# EAGLE design RightSensor (EAGLE 9.1.3)
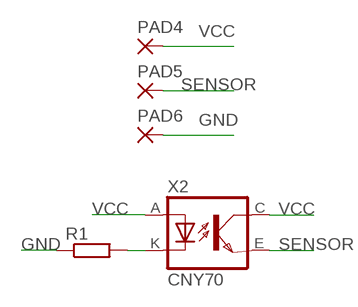
[diagram p0: schematic, sheet 1]

## Parts
PAD4  WIREPADSMD1,27-254  [SMD1,27-2,54]
PAD5  WIREPADSMD1,27-254  [SMD1,27-2,54]
PAD6  WIREPADSMD1,27-254  [SMD1,27-2,54]
R1  RCL_R-EU_R0805  [RCL_R0805]
X2  CNY70  [4]

## Nets
GND: PAD6.1(P) R1.1
N$1: R1.2 X2.K(C)
SENSOR: PAD5.1(P) X2.E(EMI)
VCC: PAD4.1(P) X2.A X2.C(COL)

## Library data of the parts
PAD4-PAD6 = wirepad:WIREPAD: Wire PAD connect wire on PCB
R1 = ScyllAlarmV3.0:RCL_R-EU_: RESISTOR, European symbol
X2 = cny70:CNY70

## Board
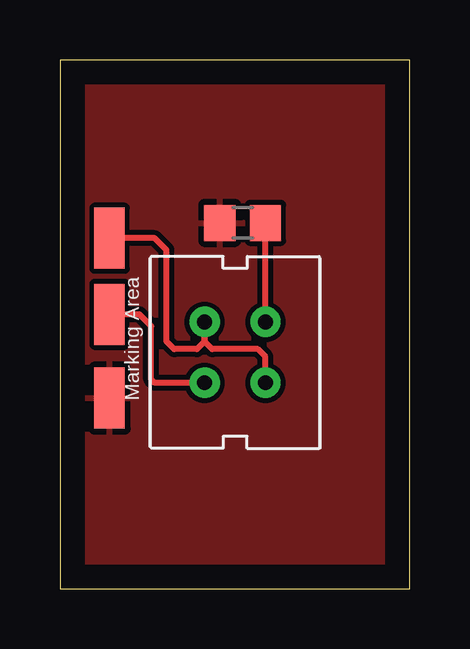
[diagram p1: board, top side]

Size 14.59 x 22.05 mm. Coordinates in mm from the lower left corner, seen from the top.
Outline: 0,0 14.59,0 14.59,22.05 0,22.05 0,0
Copper layers (1*16): Top 0.035mm / dielectric 1.5mm / Bottom 0.035mm
Design rules "default": minimum track width 10mil, minimum drill 24mil, track to track 8mil, track to pad 8mil, pad to pad 8mil, via to via 8mil, smd to smd 8mil, copper to edge 40mil, drill to drill 8mil, minimum pad ring 10mil, minimum via ring 8mil, stop-mask expansion 4mil, vias tented up to drill 0mil, thermal gap 10mil

### Footprints (pad centres in the part's own frame; a part is rotated, then mirrored left to right if it is on the bottom)
SMD1,27-2,54 = smd 1.27 x 2.54: 1 0,0
RCL_R0805 = smd 1.3 x 1.5: 1 -0.95,0; 2 0.95,0
4 = drill 0.61 pad 1.27: A -1.27,1.27; C 1.27,-1.27; E 1.27,1.27; K -1.27,-1.27

### Placement (x,y rotation side)
PAD4  2.06,14.62 180 top
PAD5  2.06,11.45 180 top
PAD6  2.06,7.95 180 top
R1  7.62,15.26 0 top
X2  7.3,9.86 180 top

### Tracks (layer width: path | path; a pad name or v marks a point on that pad's centre or on a via)
GND
  pour Top: 0,22.07 14.61,22.07 14.61,0 0,0
N$1
  Top 0.254: X2.K R1.2
SENSOR
  Top 0.254: X2.E 3.95,8.59 3.81,8.73 3.81,10.95 3.32,11.45 PAD5.1
VCC
  Top 0.254: X2.A 8.57,9.68 8.26,10 6.35,10 6.03,10.32 | 6.03,10.32 X2.C 6.03,10.32 | 6.03,10.32 5.71,10 4.76,10 4.45,10.32 4.45,14.13 3.95,14.62 PAD4.1